# EAGLE schematic SHT31 (EAGLE 9.4.2)
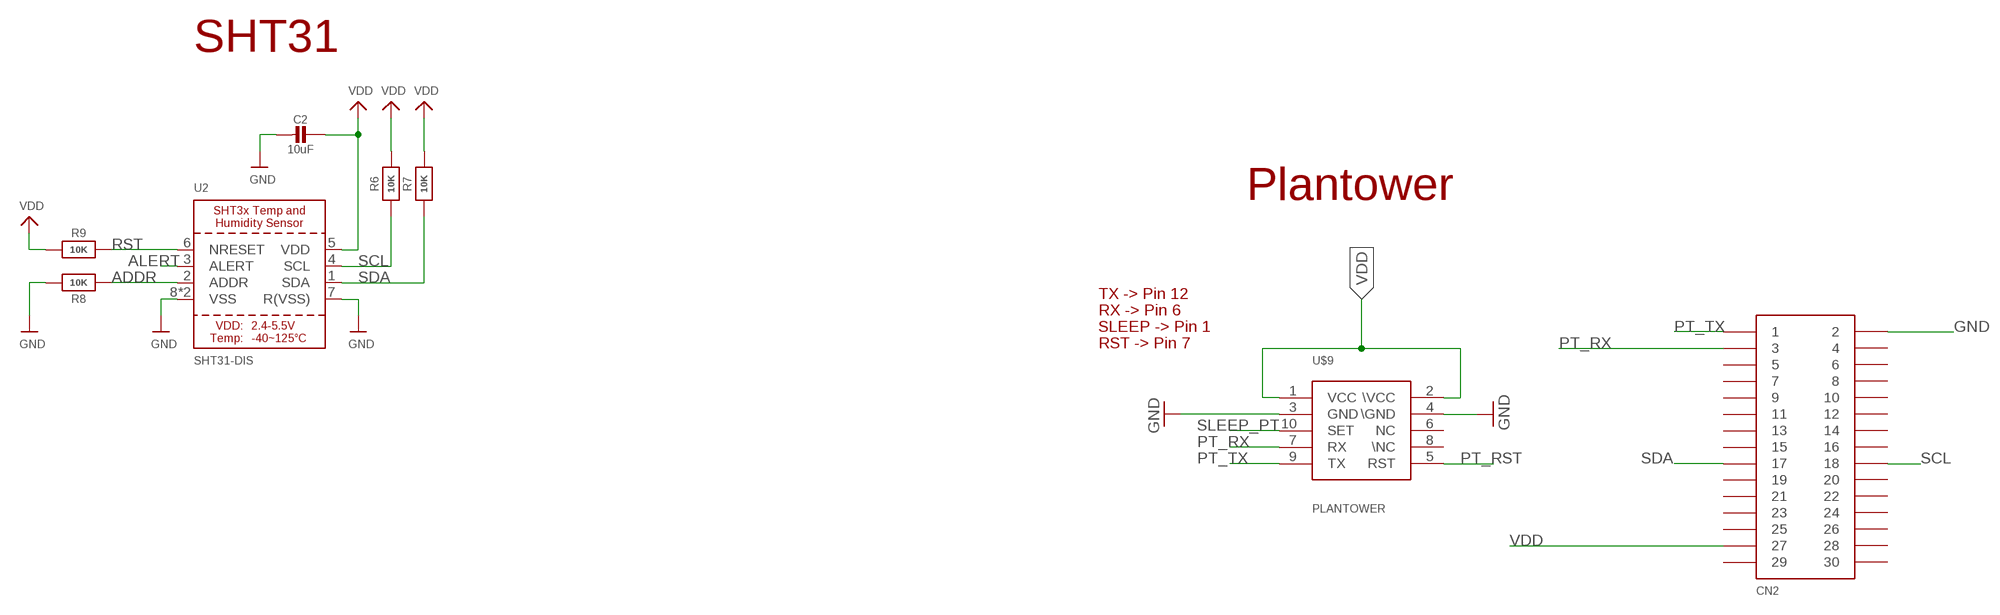
[diagram p0: schematic, sheet 1]

## Parts
C2  10uF  CAP_CERAMIC_1206  [_1206]
CN2  CON_PINHD-2X15  [2X15SMD]
R6  10K  RESISTOR_1206MP  [_1206MP]
R7  10K  RESISTOR_1206MP  [_1206MP]
R8  10K  RESISTOR_1206MP  [_1206MP]
R9  10K  RESISTOR_1206MP  [_1206MP]
U2  SHT31-DIS  SHT3X  [SHT3X]
U$9  PLANTOWER  [CONN]

## Nets
ADDR: R8.1 U2.2(ADDR)
ALERT: U2.3(ALERT)
GND: C2.2 CN2.P$2 R8.2 U2.7(R(VSS)) U2.8(VSS) U2.THERMAL(VSS) U$9.3(GND) U$9.4(\GND)
PT_RST: U$9.5(RST)
PT_RX: CN2.P$3 U$9.7(RX)
PT_TX: CN2.P$1 U$9.9(TX)
RST: R9.2 U2.6(NRESET)
SCL: CN2.P$18 R6.1 U2.4(SCL)
SDA: CN2.P$17 R7.1 U2.1(SDA)
SLEEP_PT: U$9.10(SET)
VDD: C2.1 CN2.P$27 R6.2 R7.2 R9.1 U2.5(VDD) U$9.1(VCC) U$9.2(\VCC)
Unconnected: CN2.P$4 CN2.P$5 CN2.P$6 CN2.P$7 CN2.P$8 CN2.P$9 CN2.P$10 CN2.P$11 CN2.P$12 CN2.P$13 CN2.P$14 CN2.P$15 CN2.P$16 CN2.P$19 CN2.P$20 CN2.P$21 CN2.P$22 CN2.P$23 CN2.P$24 CN2.P$25 CN2.P$26 CN2.P$28 CN2.P$29 CN2.P$30 U$9.6(NC) U$9.8(\NC)

## Notes on the sheet
- SHT31
- Plantower
- TX -> Pin 12
- RX -> Pin 6
- SLEEP -> Pin 1
- RST -> Pin 7

## Library data of the parts
C2 = microbuilder:CAP_CERAMIC: Ceramic Capacitors For new designs, use the packages preceded by an '_' character since they are more reliable: The following footprints should be used on most boards: _0402 - Standard footprint for regular board layouts _0603 - Standard footprint for regular board layouts _0805 - Standard footprint for regular board layouts _1206 - Standard footprint for regular board layouts For extremely tight-pitch boards where space is at a premium, the following 'micro-pitch' footprints can be used (smaller pads, no silkscreen outline, etc.): _0402MP - Micro-pitch footprint for very dense/compact boards _0603MP - Micro-pitch footprint for very dense/compact boards _0805MP - Micro-pitch footprint for very dense/compact boards _1206MP - Micro-pitch footprint for very dense/compact boards
CN2 = akita:CON_PINHD-2X15
R6-R9 = microbuilder:RESISTOR: Resistors For new designs, use the packages preceded by an '_' character since they are more reliable: The following footprints should be used on most boards: _0402 - Standard footprint for regular board layouts _0603 - Standard footprint for regular board layouts _0805 - Standard footprint for regular board layouts _1206 - Standard footprint for regular board layouts For extremely tight-pitch boards where space is at a premium, the following 'micro-pitch' footprints can be used (smaller pads, no silkscreen outline, etc.): _0402MP - Micro-pitch footprint for very dense/compact boards _0603MP - Micro-pitch footprint for very dense/compact boards _0805MP - Micro-pitch footprint for very dense/compact boards _1206MP - Micro-pitch footprint for very dense/compact boards
U2 = microbuilder:SHT3X: SHT3x - Digital Temperature and Humidity Sensor Supply Voltage: 2.4-5.5V Humidity Accuracy: SHT30 = +/-3%RH, SHT31 = +/-2%RH Temperature Sensor: -40~125°C (+/-0.3°C from 10-55C)
U$9 = Airbeam:PLANTOWER